# EAGLE design FMCWRadarv2 (EAGLE 9.4.0)
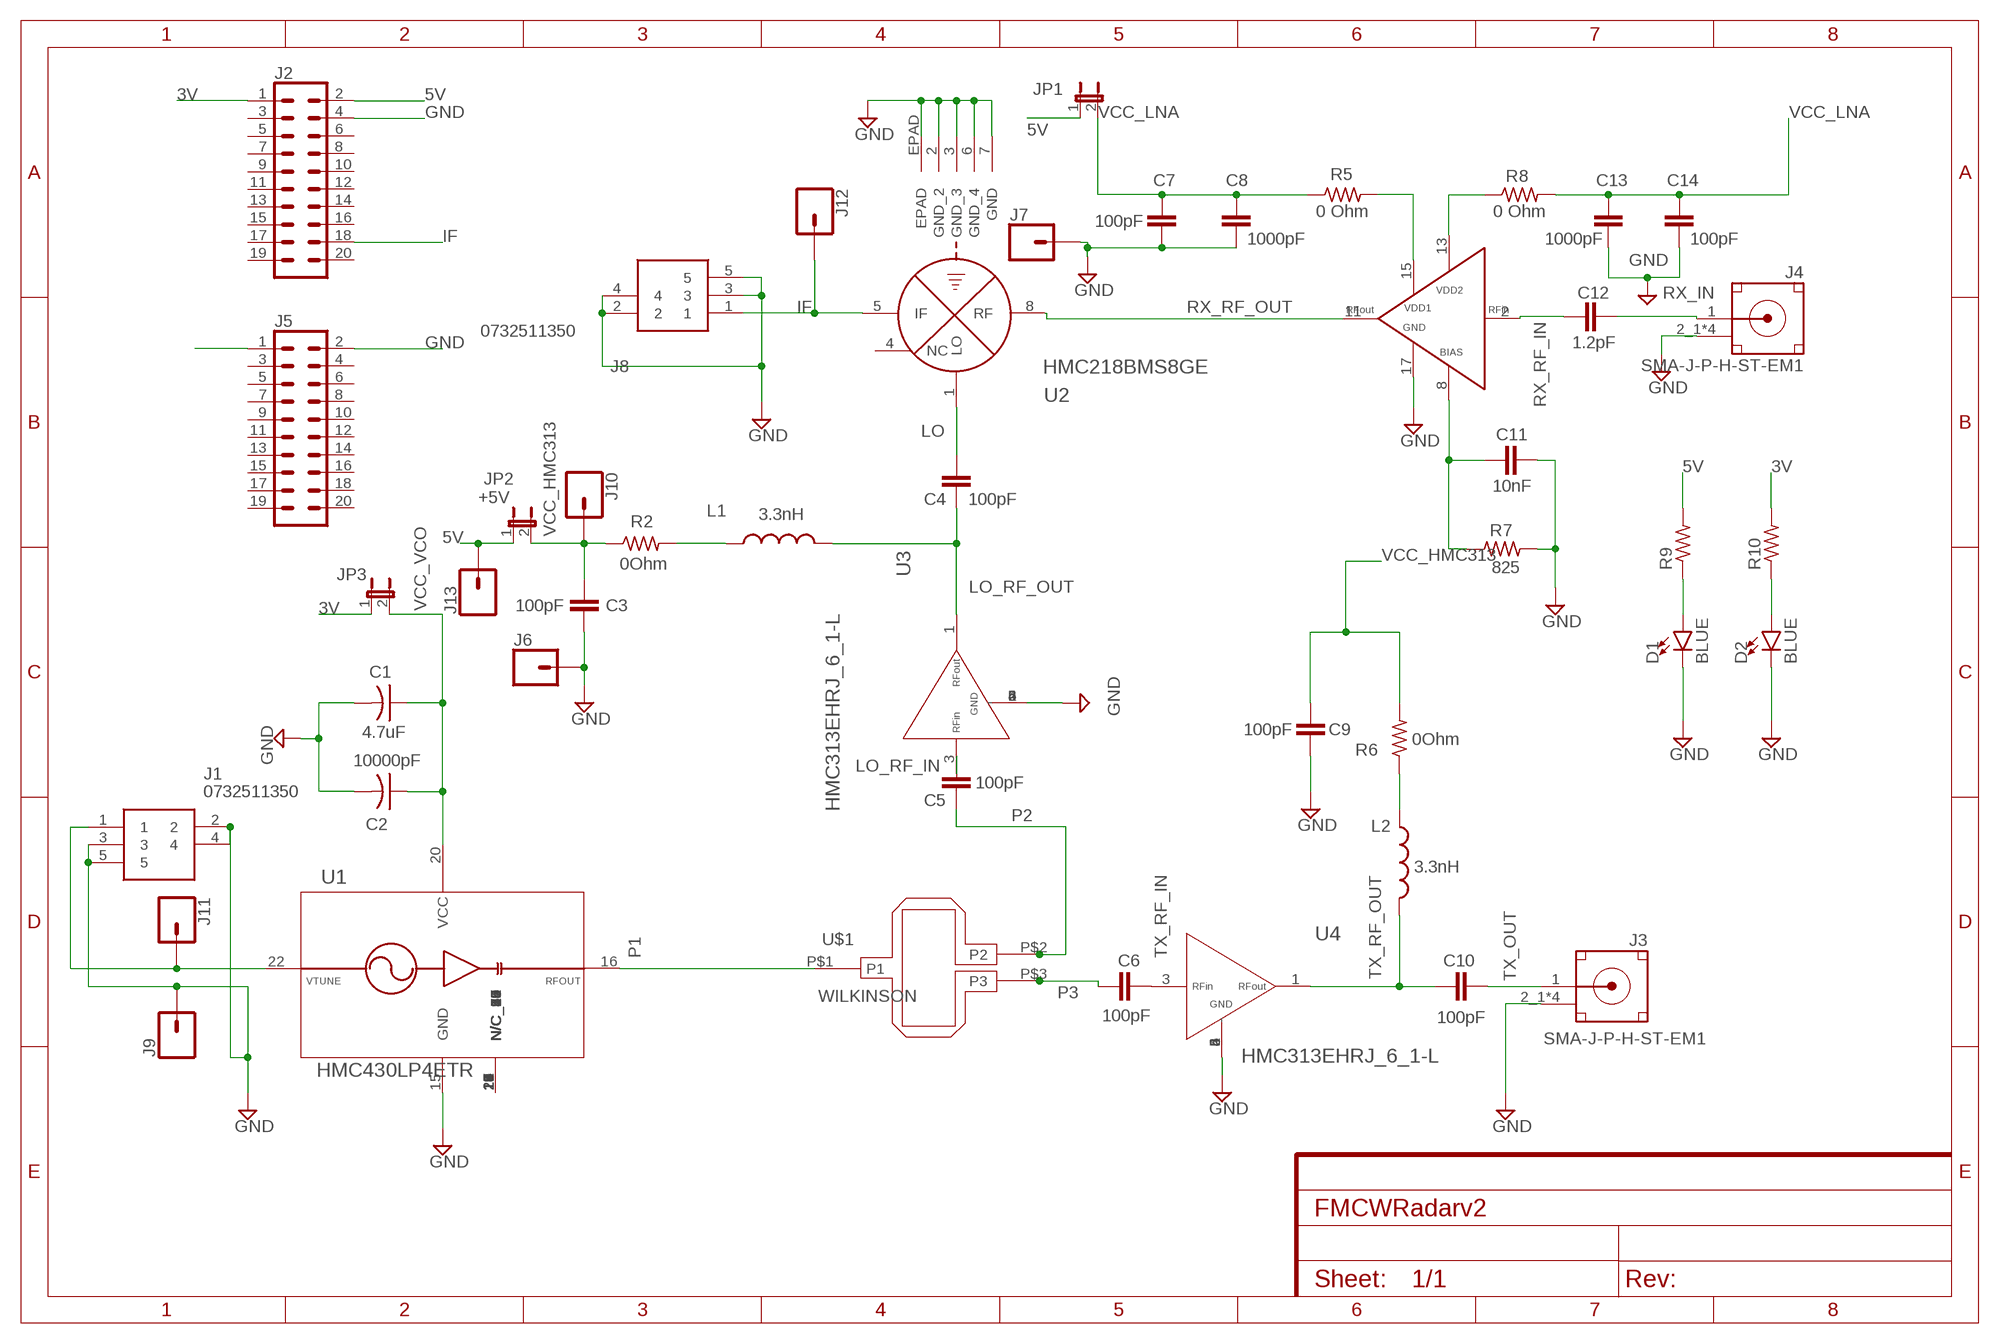
[diagram p0: schematic, sheet 1]

## Parts
C1  4.7uF  C-USC0805  [C0805]
C2  10000pF  C-USC0603  [C0603]
C3  100pF  C-EUC0805  [C0805]
C4  100pF  C-EUC0402  [C0402]
C5  100pF  C-EUC0402  [C0402]
C6  100pF  C-EUC0402  [C0402]
C7  100pF  C-EUC0603  [C0603]
C8  1000pF  C-EUC0603  [C0603]
C9  100pF  C-EUC0805  [C0805]
C10  100pF  C-EUC0402  [C0402]
C11  10nF  C-EUC0402  [C0402]
C12  1.2pF  C-EUC0402  [C0402]
C13  1000pF  C-EUC0603  [C0603]
C14  100pF  C-EUC0603  [C0603]
D1  BLUE  LED-BLUE1206  [LED-1206]
D2  BLUE  LED-BLUE1206  [LED-1206]
J1  0732511350  [0732511350]
J2  CONN_10X2  [2X10]
J3  SMA-J-P-H-ST-EM1  [SMA-J-P-H-ST-EM1]
J4  SMA-J-P-H-ST-EM1  [SMA-J-P-H-ST-EM1]
J5  CONN_10X2  [2X10]
J6  CONN_01  [1X01]
J7  CONN_01  [1X01]
J8  0732511350  [0732511350]
J9  CONN_01  [1X01]
J10  CONN_01  [1X01]
J11  CONN_01  [1X01]
J12  CONN_01  [1X01]
J13  CONN_01  [1X01]
JP1  +5V  JP1M  [JP1M]
JP2  +5V  JP1M  [JP1M]
JP3  +5V  JP1M  [JP1M]
L1  3.3nH  L-USL0805  [L0805]
L2  3.3nH  L-USL0805  [L0805]
R2  0Ohm  R-US_R0805  [R0805]
R5  0 Ohm  R-US_R0402  [R0402]
R6  0Ohm  R-US_R0805  [R0805]
R7  825  R-US_R0402  [R0402]
R8  0 Ohm  R-US_R0402  [R0402]
R9  R-US_R0805  [R0805]
R10  R-US_R0805  [R0805]
U1  HMC430LP4ETR  [SMT_24]
U2  HMC218BMS8GE  [HRH_8_1]
U3  HMC313EHRJ_6_1-L  [HRJ_6_1-L]
U4  HMC313EHRJ_6_1-L  [HRJ_6_1-L]
U5  HMC717ALP3E  [QFN50P300X300X100-17N]
U$1  WILKINSON  [WILKINSON]

## Nets
3V [power]: J2.1 JP3.1 R10.2
5V [power]: J2.2 J13.1 JP1.1 JP2.1 R9.2
GND [GND]: C1.2 C2.2 C3.2 C7.2 C8.2 C9.2 C11.1 C13.2 C14.2 D1.C D2.C J1.2 J1.3 J1.4 J1.5 J2.4 J3.2_1(GND) J3.2_2(GND) J3.3_1(GND) J3.3_2(GND) J4.2_1(GND) J4.2_2(GND) J4.3_1(GND) J4.3_2(GND) J5.2 J6.1 J7.1 J8.2 J8.3 J8.4 J8.5 J9.1 R7.2 U1.15(GND) U2.2(GND_2) U2.3(GND_3) U2.6(GND_4) U2.7(GND) U2.EPAD U3.2(GND_2) U3.4(GND_3) U3.5(GND_4) U3.6(GND) U4.2(GND_2) U4.4(GND_3) U4.5(GND_4) U4.6(GND) U5.17(GND)
IF [signal]: J2.18 J8.1 J12.1 U2.5(IF)
LO [signal]: C4.2 U2.1(LO)
LO_RF_IN [signal]: C5.2 U3.3(RFIN)
LO_RF_OUT [signal]: C4.1 L1.2 U3.1(RFOUT)
N$2: J5.1
N$4 [signal]: R5.2 U5.15(VDD1)
N$6 [signal]: R8.1 U5.13(VDD2)
N$9 [signal]: C11.2 R7.1 U5.8(BIAS)
N$13 [signal]: J1.1 J11.1 U1.22(VTUNE)
N$15 [signal]: D1.A R9.1
N$16 [signal]: D2.A R10.1
N$22 [signal]: L2.1 R6.1
N$23 [signal]: L1.1 R2.2
P1 [RF]: U1.16(RFOUT) U$1.P$1(P1)
P2 [RF]: C5.1 U$1.P$2(P2)
P3 [signal]: C6.1 U$1.P$3(P3)
RX_IN [signal]: C12.1 J4.1(SIGNAL)
RX_RF_IN [signal]: C12.2 U5.2(RFIN)
RX_RF_OUT [signal]: U2.8(RF) U5.11(RFOUT)
TX_OUT [RF]: C10.2 J3.1(SIGNAL)
TX_RF_IN [signal]: C6.2 U4.3(RFIN)
TX_RF_OUT [signal]: C10.1 L2.2 U4.1(RFOUT)
VCC_HMC313 [power]: C3.1 C9.1 J10.1 JP2.2 R2.1 R6.2
VCC_LNA [power]: C7.1 C8.1 C13.1 C14.1 JP1.2 R5.1 R8.2
VCC_VCO [power]: C1.1 C2.1 JP3.2 U1.20(VCC)
Unconnected: J2.3 J2.5 J2.6 J2.7 J2.8 J2.9 J2.10 J2.11 J2.12 J2.13 J2.14 J2.15 J2.16 J2.17 J2.19 J2.20 J5.3 J5.4 J5.5 J5.6 J5.7 J5.8 J5.9 J5.10 J5.11 J5.12 J5.13 J5.14 J5.15 J5.16 J5.17 J5.18 J5.19 J5.20 U1.1(N/C_2) U1.2(N/C_3) U1.3(N/C_4) U1.4(N/C_5) U1.5(N/C_6) U1.6(N/C_7) U1.7(N/C_8) U1.8(N/C_9) U1.9(N/C_10) U1.10(N/C_11) U1.11(N/C_12) U1.12(N/C_13) U1.13(N/C_14) U1.14(N/C_15) U1.17(N/C_16) U1.18(N/C_17) U1.19(N/C_18) U1.21(N/C_19) U1.23(N/C_20) U1.24(N/C) U2.4(NC)

## Library data of the parts
C1 C2 = rcl-2:C-US: CAPACITOR, American symbol
C3-C14 = rcl-2:C-EU: CAPACITOR, European symbol
D1 D2 = SparkFun-LED:LED-BLUE: Blue SMD LED Used in manufacturing of various products at SparkFun Packages: 0603 - SMD 0603 package [Product Link] <http://www.digikey.com/product-detail/en/SMLE12BC7TT86/511-1589-2-ND/1641808> 1206 - SMD1206 package [Product Link] <http://www.digikey.com/product-detail/en/lite-on-inc/LTST-C150TBKT/160-1643-1-ND/573584> SparkFun Products: ESP8266 Thing-Dev Board <https://www.sparkfun.com/products/13711> RedBoard <https://www.sparkfun.com/products/12757>; PROD_ID: DIO-09911
J1 J8 = sma_surface_mount:0732511350: RF Connectors / Coaxial Connectors SMA ST PCB-JCK STD SMT Source: Datasheet <https://www.molex.com/webdocs/datasheets/pdf/en-us/0732511350_RF_COAX_CONNECTORS.pdf>; DESCRIPTION: RF Connectors / Coaxial Connectors SMA ST PCB-JCK STD SMT; HEIGHT: 9.66mm; MANUFACTURER_NAME: Molex; MANUFACTURER_PART_NUMBER: 0732511350; MOUSER_PART_NUMBER: N/A; MOUSER_PRICE-STOCK: https://www.mouser.com/Search/Refine.aspx?Keyword=N%2FA
J2 J5 = SparkFun-Connectors:CONN_10X2: Multi connection point. Often used as Generic Header-pin footprint for 0.1 inch spaced/style header connections On any of the 0.1 inch spaced packages, you can populate with these: Break Away Headers - Straight <https://www.sparkfun.com/products/116> (PRT-00116) Break Away Male Headers - Right Angle <https://www.sparkfun.com/products/553> (PRT-00553) Female Headers <https://www.sparkfun.com/products/115> (PRT-00115) Break Away Headers - Machine Pin <https://www.sparkfun.com/products/117> (PRT-00117) Break Away Female Headers - Swiss Machine Pin <https://www.sparkfun.com/products/743> (PRT-00743) Special note about the "SPECIAL" package: This was SPECIALLY designed to be used with our Graphic LCD Backpack. Be sure you want to use this! It is not only staggered on each line of header holes, but IT IS ALSO offset of the center point of the top and bottom lines by 5 mil. This causes the headers to lock into place on the "standard" footprint on the LCD screen. The extra squares on the tdocu layer are there simply to reference other pins (if you were to actually populate a longer header than ten long - this is what we do with the backpacks).
J3 J4 = SMA-J-P-H-ST-EM1:SMA-J-P-H-ST-EM1: Connector SMA F 50Ohm Solder ST Edge Mount Gold Over Nickel Tray; DESCRIPTION: Connector SMA F 50Ohm Solder ST Edge Mount Gold Over Nickel Tray; DIGI-KEY_PART_NUMBER: SAM8857-ND; DIGI-KEY_PURCHASE_URL: https://www.digikey.com/product-detail/en/samtec-inc/SMA-J-P-H-ST-EM1/SAM8857-ND/2602450?utm_source=snapeda&utm_medium=aggregator&utm_campaign=symbol; MF: Samtec; MP: SMA-J-P-H-ST-EM1; PACKAGE: None
J6 J7 J9-J13 = SparkFun-Connectors:CONN_01: Single connection point. Often used as Generic Header-pin footprint for 0.1 inch spaced/style header connections On any of the 0.1 inch spaced packages, you can populate with these: Break Away Headers - Straight <https://www.sparkfun.com/products/116> (PRT-00116) Break Away Male Headers - Right Angle <https://www.sparkfun.com/products/553> (PRT-00553) Female Headers <https://www.sparkfun.com/products/115> (PRT-00115) Break Away Headers - Machine Pin <https://www.sparkfun.com/products/117> (PRT-00117) Break Away Female Headers - Swiss Machine Pin <https://www.sparkfun.com/products/743> (PRT-00743) This device is also useful as a general connection point to wire up your design to another part of your project. Our various solder wires solder well into these plated through hole pads. Hook-Up Wire - Assortment (Stranded, 22 AWG) <https://www.sparkfun.com/products/11375> (PRT-11375) Hook-Up Wire - Assortment (Solid Core, 22 AWG) <https://www.sparkfun.com/products/11367> (PRT-11367) View the entire wire category on our website here <https://www.sparkfun.com/categories/141> Special notes: SMTSO-256-ET is a "flush mount" nut for a 4-40 screw. We mostly use this on specialty testbeds; it is a nice way to connect hardware to your PCB at an adjustable hieght. Also note, the SNAP packages are for using a snappable style connector. We sell a baggie of snaps and they are also used on two LilyPad designs: Snap Assortment - 30 pack (male and female) <https://www.sparkfun.com/products/11347> (DEV-11347) LilyPad Arduino SimpleSnap <https://www.sparkfun.com/products/10941> (DEV-10941) LilyPad SimpleSnap Protoboard <https://www.sparkfun.com/products/10940> (DEV-10940)
JP1-JP3 = jumper:JP1M
L1 L2 = rcl-2:L-US: INDUCTOR, American symbol
R2 R5-R10 = rcl-2:R-US_: RESISTOR, American symbol
U1 = HCM430LP4:HMC430LP4ETR; MANUFACTURER_PART_NUMBER: HMC430LP4ETR; VENDOR: Analog Devices Inc
U2 = HMC218BMSGE:HMC218BMS8GE
U3 U4 = HMC313:HMC313E; MANUFACTURER_PART_NUMBER: HMC313E; VENDOR: Analog Devices Inc
U5 = QFN50P300X300X100-17N:HMC717ALP3E
U$1 = wilkinson:WILKINSON

## Net classes
1 RF: width 1.128 mm
2 signal: width 0.254 mm
4 GND: width 0.203 mm, drill 0.305 mm, clearance 0.152 mm

## Board
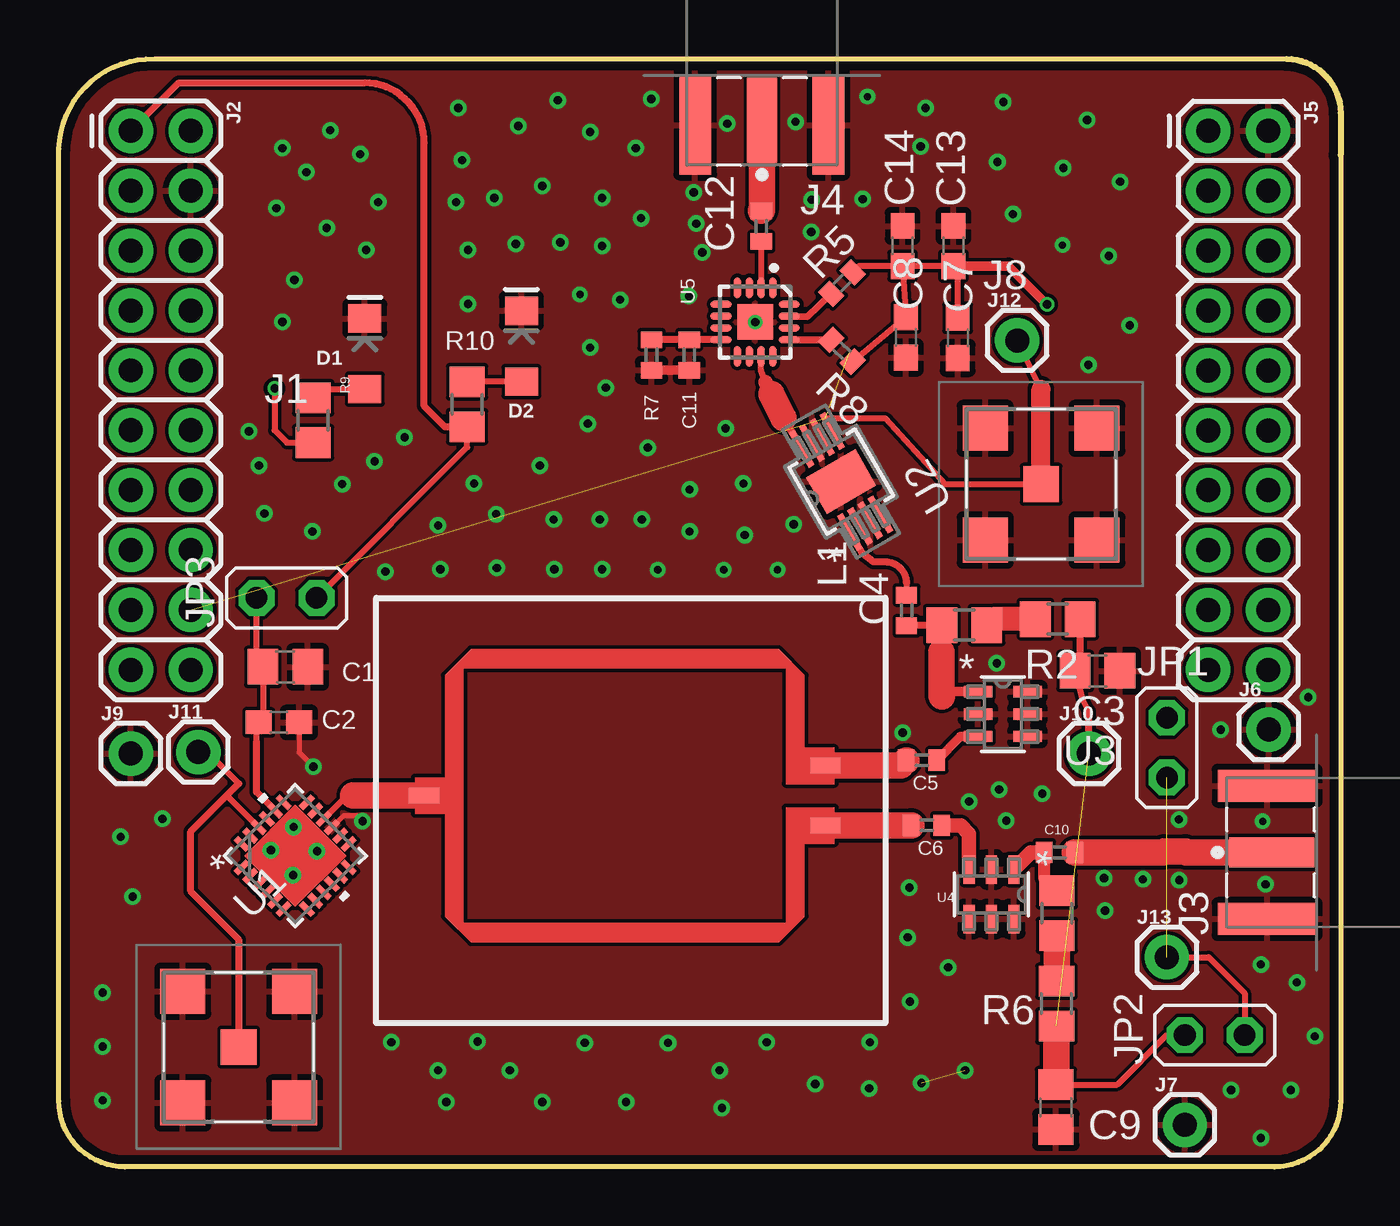
[diagram p1: board, top side]
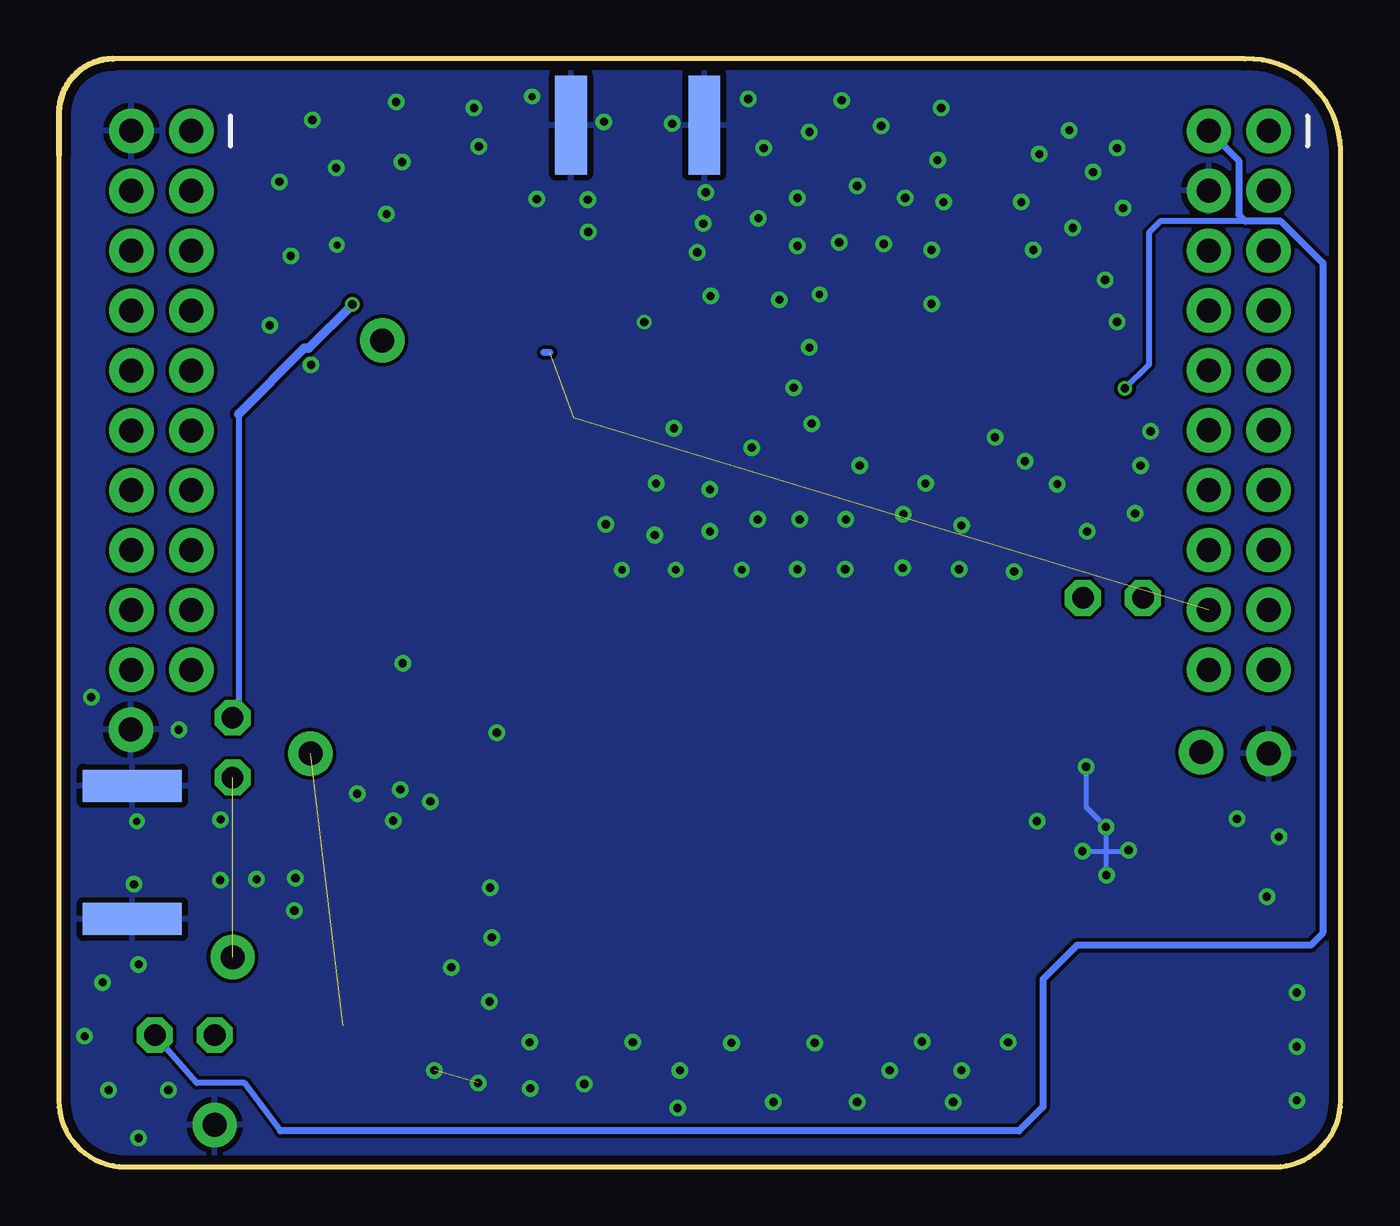
[diagram p2: board, bottom side, seen from below]

Size 54.36 x 46.99 mm. Coordinates in mm from the lower left corner, seen from the top.
Outline: 0,43.18 arc-90 4.06,46.99 52.07,46.99 arc-90 54.36,44.7 54.36,42.93 54.36,2.79 arc-90 51.56,0 2.79,0 arc-90 0,2.79 0,43.18
Copper layers (1*16): Top 0.035559375mm / dielectric 1.6mm / Bottom 0.035559375mm
Design rules "oshpark-2layer *": minimum track width 6mil, minimum drill 10mil, track to track 6mil, track to pad 6mil, pad to pad 6mil, via to via 6mil, smd to smd 6mil, copper to edge 15mil, drill to drill 6mil, minimum pad ring 5mil, minimum via ring 5mil, stop-mask expansion 8mil, vias tented up to drill 15mil, thermal gap 10mil

### Footprints (pad centres in the part's own frame; a part is rotated, then mirrored left to right if it is on the bottom)
C0805 = smd 1.3 x 1.5: 1 -0.95,0; 2 0.95,0
C0603 = smd 1.1 x 1: 1 -0.85,0; 2 0.85,0
C0402 = smd 0.7 x 0.9: 1 -0.65,0; 2 0.65,0
LED-1206 = smd 1.2 x 1.4: A -1.5,0; C 1.5,0
0732511350 = smd 1.52 x 1.52: 1 0,0 | smd 1.91 x 1.91: 2 -2.37,2.37; 3 -2.37,-2.37; 4 2.37,-2.37; 5 2.37,2.37
2X10 = drill 1.016 pad 1.88: 1 0,0; 2 0,2.54; 3 2.54,0; 4 2.54,2.54; 5 5.08,0; 6 5.08,2.54; 7 7.62,0; 8 7.62,2.54; 9 10.16,0; 10 10.16,2.54; 11 12.7,0; 12 12.7,2.54; 13 15.24,0; 14 15.24,2.54; 15 17.78,0; 16 17.78,2.54; 17 20.32,0; 18 20.32,2.54; 19 22.86,0; 20 22.86,2.54
SMA-J-P-H-ST-EM1 = smd 1.27 x 3.6: 1 0,0 | smd 1.35 x 4.2: 2_1 -2.825,0.2; 3_1 2.825,0.2 | smd 1.35 x 4.2 bottom: 2_2 -2.825,0.2; 3_2 2.825,0.2
1X01 = drill 1.016 pad 1.88: 1 0,0
JP1M = drill 0.914 pad 1.524 octagon: 1 0,-1.27; 2 0,1.27
L0805 = smd 1.3 x 1.5: 1 -0.95,0; 2 0.95,0
R0805 = smd 1.3 x 1.5: 1 -0.95,0; 2 0.95,0
R0402 = smd 0.7 x 0.9: 1 -0.65,0; 2 0.65,0
SMT_24 = smd 0.711 x 0.254: 1 -1.949,1.25; 2 -1.949,0.75; 3 -1.949,0.25; 4 -1.949,-0.25; 5 -1.949,-0.75; 6 -1.949,-1.25; 13 1.949,-1.25; 14 1.949,-0.75; 15 1.949,-0.25; 16 1.949,0.25; 17 1.949,0.75; 18 1.949,1.25 | smd 0.254 x 0.711: 7 -1.25,-1.949; 8 -0.75,-1.949; 9 -0.25,-1.949; 10 0.25,-1.949; 11 0.75,-1.949; 12 1.25,-1.949; 19 1.25,1.949; 20 0.75,1.949; 21 0.25,1.949; 22 -0.25,1.949; 23 -0.75,1.949; 24 -1.25,1.949
HRH_8_1 = smd 1.711 x 0.27: 1 -2.04,0.75; 2 -2.04,0.25; 3 -2.04,-0.25; 4 -2.04,-0.75; 5 2.04,-0.75; 6 2.04,-0.25; 7 2.04,0.25; 8 2.04,0.75 | smd 1.78 x 2.41: EPAD 0,0
HRJ_6_1-L = smd 1.206 x 0.48: 1 -1.049,0.95; 2 -1.049,0; 3 -1.049,-0.95; 4 1.049,-0.95; 5 1.049,0; 6 1.049,0.95
QFN50P300X300X100-17N = smd 0.9 x 0.3: 1 -1.45,0.75; 2 -1.45,0.25; 3 -1.45,-0.25; 4 -1.45,-0.75; 9 1.45,-0.75; 10 1.45,-0.25; 11 1.45,0.25; 12 1.45,0.75 | smd 0.3 x 0.9: 5 -0.75,-1.45; 6 -0.25,-1.45; 7 0.25,-1.45; 8 0.75,-1.45; 13 0.75,1.45; 14 0.25,1.45; 15 -0.25,1.45; 16 -0.75,1.45 | smd 1.5 x 1.5: 17 0,0
WILKINSON = smd 1.27 x 0.66: P$1 -6.858,0 | smd 1.27 x 0.635: P$2 10.16,1.27; P$3 10.16,-1.27

### Placement (x,y rotation side)
C1  9.6,21.2 0 top
C2  9.33,18.85 0 top
C3  44.05,21.04 0 top
C4  35.95,23.6 90 top
C5  36.58,17.24 0 top
C6  36.8,14.48 0 top
C7  38.12,35.16 270 top
C8  35.92,35.18 270 top
C9  42.28,2.53 270 top
C10  42.44,13.34 0 top
C11  26.73,34.43 90 top
C12  29.78,39.9 270 top
C13  37.93,39.06 90 top
C14  35.78,39.06 90 top
D1  12.97,34.49 90 top
D2  19.61,34.81 90 top
J1  7.62,5.08 0 top
J2  3.05,43.94 270 top
J3  51.44,13.34 90 top
J4  29.81,44.39 180 top
J5  48.74,43.94 270 top
J6  51.31,18.54 0 top
J7  47.75,1.78 0 top
J8  41.66,28.96 0 top
J9  3.05,17.53 0 top
J10  43.69,17.53 0 top
J11  5.91,17.59 0 top
J12  40.64,35.05 0 top
J13  46.99,8.89 0 top
JP1  46.99,17.78 0 top
JP2  49.02,5.59 90 top
JP3  9.65,24.13 90 top
L1  38.4,22.97 180 top
L2  42.32,10.76 90 top
R2  42.36,23.23 180 top
R5  33.21,37.48 225 top
R6  42.31,6.92 270 top
R7  25.13,34.43 270 top
R8  33.21,34.61 315 top
R9  10.78,31.67 270 top
R10  17.31,32.34 270 top
U1  10.02,13.2 45 top
U2  33.17,29.06 120 top
U3  40.03,19.2 0 top
U4  39.55,11.56 270 top
U5  29.53,35.83 270 top
U$1  22.35,15.75 0 top

### Tracks (layer width: path | path; a pad name or v marks a point on that pad's centre or on a via)
3V
  Top 0.254: JP3.1 17.31,30.52 R10.2
  Top 0.305: J2.1 5.08,45.97 12.95,45.97 arc-90 15.49,43.43 15.49,32.26 16.36,31.39 R10.2
5V  (via drill 0.35)  (1 unrouted)
  Top 0.254: v9.14,33.02 9.14,31.24 9.67,30.72 R9.2 | J13.1 48.77,8.89 50.29,7.37 JP2.1
  Bottom 0.254: 4.04,40.11 7.64,40.11 8.13,39.62 8.13,34.04 v9.14,33.02 | 44.96,1.52 46.48,3.56 48.51,3.56 JP2.1
  Bottom 0.305: J2.2 4.32,42.67 4.32,40.39 4.04,40.11 2.53,40.11 0.78,38.35 0.76,38.35 0.76,9.91 1.27,9.4 11.18,9.4 12.62,7.95 12.62,2.54 13.64,1.52 44.96,1.52
GND  (via drill 0.3 pad 0.66, 0.35, 0.35 pad 0.7)  (1 unrouted)
  Top 0.203: U1.15 11.59,14.4 12.08,14.89 12.64,14.89 v12.88,14.66 | v10.79,16.97 10.18,17.58 C2.2
  Top 0.305: 35.94,34.31 C8.2
  Top 0.406: C11.1 R7.2
  Bottom 0.203: v10.79,16.97 10.79,15.26 v9.95,14.41 9.95,12.39 v9.93,12.37 | v10.95,13.39 9.04,13.39 v8.99,13.44
  other vias: 42.56,39.1 28.19,25.32 30.48,25.32 22.1,37.01 25.4,25.32 51.05,14.66 34.29,45.39 25.83,5.26 28.12,2.49 30.02,5.28 32.08,3.51 36.58,3.56 36.09,7.01 37.72,8.46 28.35,44.25 18.57,25.4 24.69,40.23 22.3,5.26 39.88,16 51.17,11.98 41.71,15.82 40.18,14.68 52.98,19.91 29.08,26.8 26.72,36.93 39.78,21.36 31.24,44.32 34.09,41.05 27.03,40.01 45.42,35.69 31.93,41.02 27.28,38.79 31.9,39.65 14.1,5.28 35.99,9.73 35.79,18.41 45.97,12.19 47.5,14.73 49.28,18.54 38.61,15.49 24.71,27.46 36.07,11.84 18.54,27.69 20.98,27.46 31.17,27.25 28.27,31.32 47.51,12.16 13.84,25.25 8.48,29.74 43.66,34.01 34.39,5.28 21.26,39.21 45.01,41.78 36.55,43.28 25.12,45.29 12.01,28.96 26.92,41.33 44.32,12.24 17.75,5.31 29.53,35.83 11.35,39.83 8.05,31.19 18.47,41.1 20.5,41.61 19.48,44.15 22.53,43.89 16.94,44.91 23.04,41.1 23.04,39.07 23.8,36.78 22.53,34.75 16.18,25.35 23.04,25.35 21.01,25.35 24.05,2.74 20.5,2.74 16.43,2.74 14.66,30.94 13.39,29.92 39.8,42.62 36.75,44.91 40.06,45.16 43.61,44.4 42.6,42.37 44.37,10.87 50.98,8.59 53.26,5.54 52.5,7.82 50.98,1.22 52.25,3.25 49.71,3.25 9.22,40.67 9.47,43.21 12.78,42.95 11.51,43.97 13.54,40.92 13.03,38.89 9.98,37.62 9.47,35.84 10.49,42.19 17.35,36.6 17.35,38.89 16.84,40.92 17.09,42.7 21.16,45.24 24.46,43.21 23.19,33.05 19.38,39.14 22.43,31.52 20.4,29.74 17.6,28.98 16.08,27.2 22.94,27.46 24.97,30.51 26.75,28.73 26.75,26.95 29.03,28.98 44.53,38.63 40.46,40.41 10.74,26.95 8.71,27.71 4.39,14.76 2.62,14 3.12,11.46 1.85,7.39 1.85,5.11 1.85,2.82 16.08,4.09 19.13,4.09 28.02,4.09 34.37,3.33 38.43,4.09
  pour Top: 0,46.99 0,0 54.36,0 54.36,46.99
  pour Bottom: 0,46.99 54.36,46.99 54.36,0 0,0
IF  (2 unrouted)
  Top 0.254: J8.1 37.59,28.96 35.05,31.75 32.51,31.75 U2.5 | 41.66,32.98 J12.1
  Top 0.813: J8.1 41.66,32.98
  Bottom 0.305: 33.53,34.54 33.78,34.54
LO
  Top 0.254: 35.95,24.76 C4.2
  Top 0.305: 35.95,24.76 arc90 35.05,25.65 34.54,25.65 34.08,26.02 U2.1
LO_RF_IN
  Top 0.406: C5.2 38.24,18.25 U3.3
LO_RF_OUT
  Top 0.254: 37.42,22.95 37.42,21.84
  Top 0.305: C4.1 35.97,22.97 L1.2
  Top 0.406: U3.1 37.64,20.15 37.45,19.96
  Top 0.61: L1.2 37.42,22.95
  Top 1.118: 37.42,21.84 37.42,19.98 37.45,19.96
N$4
  Top 0.305: U5.15 31.75,36.07 R5.2
N$6
  Top 0.305: U5.13 R8.1 arc-90 R8.1
N$9
  Top 0.305: U5.8 C11.2 R7.1
N$13
  Top 0.254: J11.1 6.29,17.59 7.62,16.26 | 7.12,15.75 U1.22
  Top 0.305: 8.25,14.62 U1.22 | J1.1 7.62,9.65 5.59,11.68 5.59,14.22 7.12,15.75 7.62,16.26
N$15
  Top 0.254: R9.1 11.15,32.99 D1.A
N$16
  Top 0.254: R10.1 17.33,33.31 D2.A
N$22
  Top 1.128: L2.1 42.32,7.89 R6.1
N$23
  Top 1.016: R2.2 39.6,23.23 L1.1
P1
  Top 0.254: U1.16 12.22,15.75
  Top 0.305: 12.48,15.75 12.22,15.75
  Top 1.128: 16.28,15.75 U$1.P$1 12.48,15.75
P2
  Top 1.128: U$1.P$2 35.71,17.02 C5.1
P3
  Top 1.128: U$1.P$3 C6.1
RX_IN
  Top 1.128: J4.1 29.81,40.58 C12.1
RX_RF_IN
  Top 0.254: C12.2 U5.2
  Top 0.406: C12.2
RX_RF_OUT
  Top 0.254: 29.97,33.27 29.78,33.79 U5.11
  Top 0.305: U2.8 30.73,31.75
  Top 0.61: 30.23,32.77 29.97,33.27
  Top 1.118: 30.73,31.75 30.23,32.77
TX_OUT
  Top 1.128: C10.2 46.83,13.34 46.88,13.39 47.76,13.39 47.81,13.34 J3.1
TX_RF_IN
  Top 0.61: C6.2 38.25,14.48 38.6,14.13 U4.3
TX_RF_OUT
  Top 0.508: L2.2 41.79,12.25 C10.1
  Top 0.61: U4.1 41.23,13.34 C10.1
VCC_HMC313  (1 unrouted)
  Top 0.254: C9.1 44.88,3.48 46.99,5.59 JP2.2 | 43.69,19.3 43.43,19.81 C3.1
  Top 0.305: R2.1 arc-90 43.45,23.37 | R2.1 43.1,23.02 | C9.1 42.3,3.5 | J10.1 43.69,19.3 | R2.1 43.31,21.25 C3.1
  Top 0.406: 42.65,3.76 42.7,3.81
  Top 0.61: C9.1 42.65,3.76
  Top 1.128: R6.2 42.31,3.46 C9.1
VCC_LNA  (via drill 0.35)
  Top 0.254: C14.1 33.94,38.21 R5.1 | C7.1 38.12,38.03 | R8.2 C8.1 C14.1 | C13.1 C14.1
  Top 0.406: C13.1 40.28,38.21 v41.91,36.58
  Top 0.508: 38.12,38.03 C13.1
  Bottom 0.254: JP1.2 46.74,19.3 46.74,31.93
  Bottom 0.406: v41.91,36.58 43.77,34.72 43.96,34.72 46.74,31.93
VCC_VCO
  Top 0.254: 8.38,18.03 8.38,18.75 C2.1 8.65,19.02 C1.1 8.38,21.47 JP3.2
  Top 0.305: U1.20 8.38,15.9 8.38,18.03